# Altium schematic sheet Sheet1.SchDoc
size A3
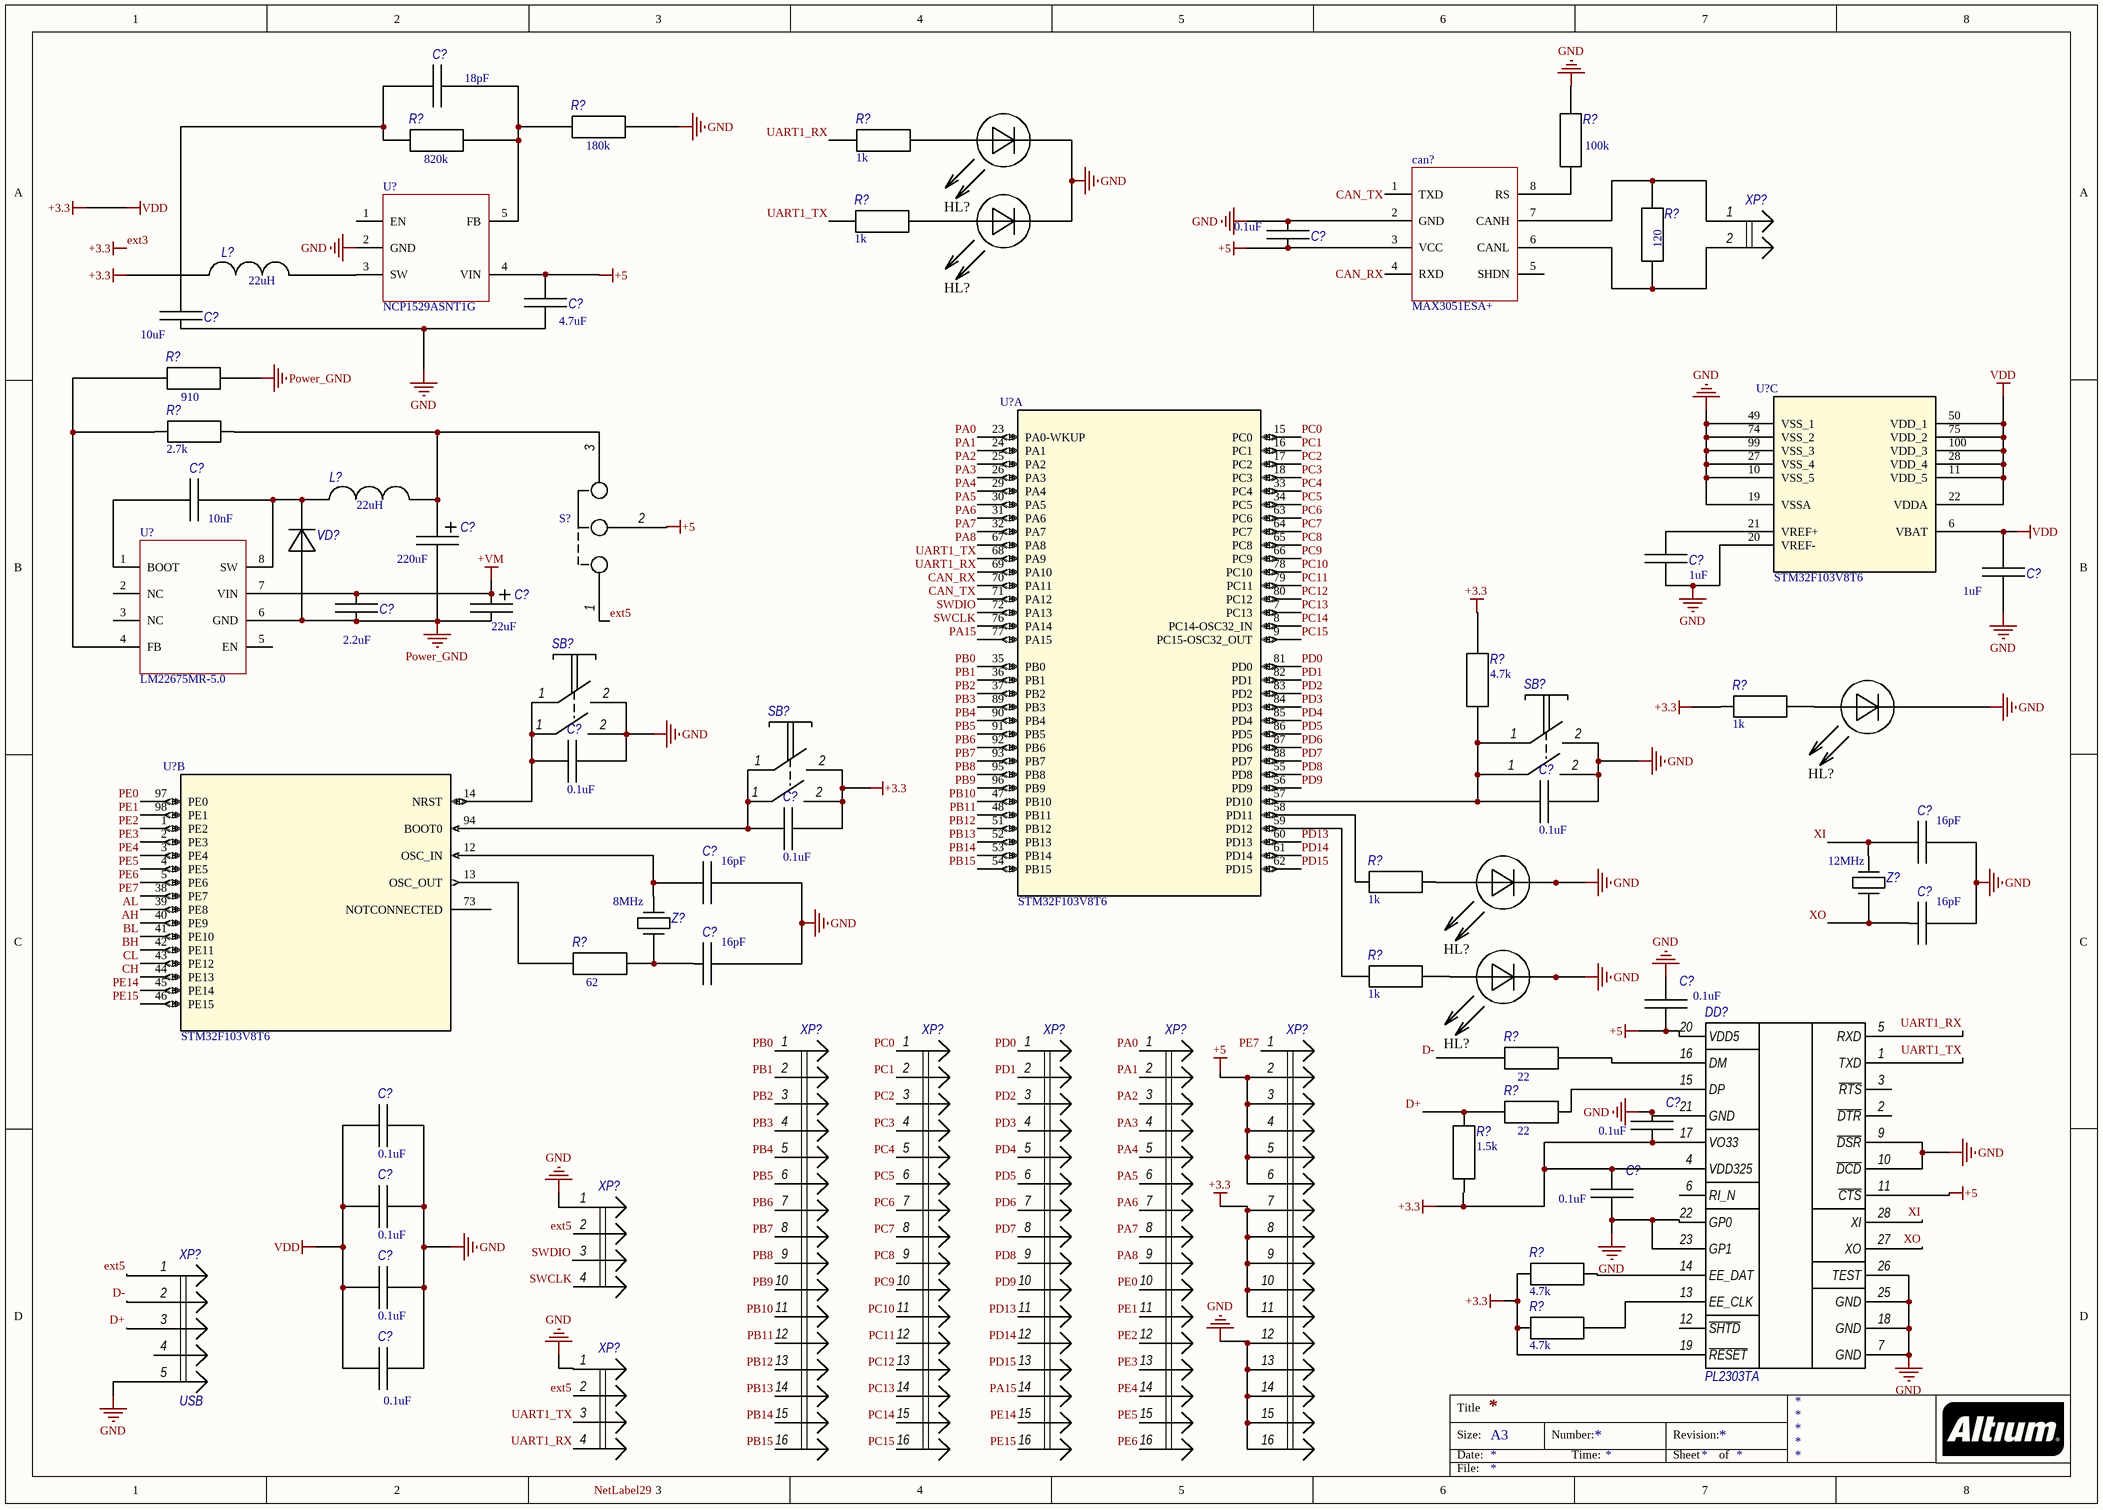
[diagram p0: Sheet1.SchDoc]

## Parts
(Parts that share a designator on the sheet are numbered #1, #2 ... from top to bottom, then left to right.)
C?#1  value 18pF  [C0805C]
C?#2  value 0.1uF  [C0805C]
C?#3  value 4.7uF  [C0805C]
C?#4  value 10uF  [C0805C]
C?#5  value 10nF  [C0805C]
C?#6  value 220uF  [CAP-8x12]
C?#7  value 1uF  [C0805C]
C?#8  value 1uF  [C0805C]
C?#9  value 2.2uF  [C1812C]
C?#10  value 22uF  [CAP-К50-35]
C?#11  value 0.1uF  [C0805C]
C?#12  value 0.1uF  [C0805C]
C?#13  value 0.1uF  [C0805C]
C?#14  value 16pF  [C0805C]
C?#15  value 16pF  [C0805C]
C?#16  value 16pF  [C0805C]
C?#17  value 16pF  [C0805C]
C?#18  value 0.1uF  [C0805C]
C?#19  value 0.1uF  [C0805C]
C?#20  value 0.1uF  [C0805C]
C?#21  value 0.1uF  [C0805C]
C?#22  value 0.1uF  [C0805C]
C?#23  value 0.1uF  [C0805C]
C?#24  value 0.1uF  [C0805C]
can?  MAX3051ESA+  [MAX3051ESA+]
DD?  PL2303TA  [SSOP28_N]
HL?#1  LED  [C0603D]  (value not drawn)
HL?#2  LED  [C0603D]  (value not drawn)
HL?#3  LED  [C0603D]  (value not drawn)
HL?#4  LED  [C0603D]  (value not drawn)
HL?#5  LED  [C0603D]  (value not drawn)
L?#1  value 22uH  [IND0488-G-E]
L?#2  value 22uH  [IND0488-G-E]
R?#1  value 180k  [C0805R]
R?#2  value 820k  [C0805R]
R?#3  value 1k  [C0805R]
R?#4  value 100k  [C0805R]
R?#5  value 1k  [C0805R]
R?#6  value 120  [C0805R]
R?#7  value 910  [C0805R]
R?#8  value 2.7k  [C0805R]
R?#9  value 4.7k  [C0805R]
R?#10  value 1k  [C0805R]
R?#11  value 1k  [C0805R]
R?#12  value 62  [C0805R]
R?#13  value 1k  [C0805R]
R?#14  value 22  [C0805R]
R?#15  value 22  [C0805R]
R?#16  value 1.5k  [C0805R]
R?#17  value 4.7k  [C0805R]
R?#18  value 4.7k  [C0805R]
S?  (no value)  [PLS-3]
SB?#1  (no value)  [TS-1170S]
SB?#2  (no value)  [TS-1170S]
SB?#3  (no value)  [TS-1170S]
U?#1  NCP1529ASNT1G  [NCP1529ASNT1G]
U?#2  STM32F103V8T6  [LQFP100-14x14mm]  (part C of 3)
U?#3  STM32F103V8T6  [LQFP100-14x14mm]  (part A of 3)
U?#4  LM22675MR-5.0  [LM22675MR-5.0/NOPB]
U?#5  STM32F103V8T6  [LQFP100-14x14mm]  (part B of 3)
VD?  (no value)  [DO-214AA]
XP?#1  (no value)  [PLS-2]
XP?#2  (no value)  [PLS-4]
XP?#3  (no value)  [PLS-16]
XP?#4  (no value)  [PLS-16]
XP?#5  (no value)  [PLS-16]
XP?#6  (no value)  [PLS-16]
XP?#7  (no value)  [PLS-16]
XP?#8  USB  [USB_Micro-B_FCI_SMD]
XP?#9  (no value)  [PLS-4]
Z?#1  value 12MHz  [HC-49S]
Z?#2  value 8MHz  [HC-49S]

## Nets
+5: C?#2.2 C?#3.1 C?#18.1 can?.3(VCC) DD?.11(~{CTS}) DD?.20(VDD5) S?.2 U?#1.4(VIN) XP?#7.2 XP?#7.3 XP?#7.4 XP?#7.5 XP?#7.6
+VM: C?#9.1 C?#10.1 U?#4.7(VIN)
ext3: C?#8.1 C?#13.2 C?#19.1 C?#20.2 C?#21.1 C?#22.1 C?#23.1 C?#24.1 DD?.4(VDD325) DD?.17(VO33) DD?.19(~{RESET}) L?#1.1 R?#9.1 R?#10.1 R?#17.1 R?#18.1 SB?#3.2 U?#2.6(VBAT) U?#2.11(VDD_5) U?#2.22(VDDA) U?#2.28(VDD_4) U?#2.50(VDD_1) U?#2.75(VDD_2) U?#2.100(VDD_3) XP?#7.7 XP?#7.8 XP?#7.9 XP?#7.10 XP?#7.11  [also labelled +3.3, VDD]
GND: C?#2.1 C?#3.2 C?#4.2 C?#7.2 C?#8.2 C?#11.2 C?#12.2 C?#14.2 C?#15.2 C?#16.2 C?#17.2 C?#18.2 C?#19.2 C?#20.1 C?#21.2 C?#22.2 C?#23.2 C?#24.2 can?.2(GND) DD?.7(GND) DD?.9(~{DSR}) DD?.10(~{DCD}) DD?.18(GND) DD?.21(GND) DD?.22(GP0) DD?.23(GP1) DD?.25(GND) DD?.26(TEST) HL?#1.2 HL?#2.2 HL?#3.2 HL?#4.2 HL?#5.2 R?#1.1 R?#4.1 SB?#1.2 SB?#2.2 U?#1.2(GND) U?#2.10(VSS_5) U?#2.19(VSSA) U?#2.20(VREF-) U?#2.27(VSS_4) U?#2.49(VSS_1) U?#2.74(VSS_2) U?#2.99(VSS_3) XP?#2.1 XP?#7.12 XP?#7.13 XP?#7.14 XP?#7.15 XP?#7.16 XP?#8.5 XP?#9.1
Power_GND: C?#6.2 C?#9.2 C?#10.2 R?#7.1 U?#4.6(GND) VD?.A
AH: U?#5.40(PE9)
AL: U?#5.39(PE8)
BH: U?#5.42(PE11)
BL: U?#5.41(PE10)
CAN_RX: can?.4(RXD) U?#3.70(PA11)
CAN_TX: can?.1(TXD) U?#3.71(PA12)
CH: U?#5.44(PE13)
CL: U?#5.43(PE12)
D+: R?#15.2 R?#16.2 XP?#8.3
D-: R?#14.2 XP?#8.2
ext5: S?.1 XP?#2.2 XP?#8.1 XP?#9.2
PA0: U?#3.23(PA0-WKUP) XP?#6.1
PA1: U?#3.24(PA1) XP?#6.2
PA2: U?#3.25(PA2) XP?#6.3
PA3: U?#3.26(PA3) XP?#6.4
PA4: U?#3.29(PA4) XP?#6.5
PA5: U?#3.30(PA5) XP?#6.6
PA6: U?#3.31(PA6) XP?#6.7
PA7: U?#3.32(PA7) XP?#6.8
PA8: U?#3.67(PA8) XP?#6.9
PA15: U?#3.77(PA15) XP?#5.14
PB0: U?#3.35(PB0) XP?#3.1
PB1: U?#3.36(PB1) XP?#3.2
PB2: U?#3.37(PB2) XP?#3.3
PB3: U?#3.89(PB3) XP?#3.4
PB4: U?#3.90(PB4) XP?#3.5
PB5: U?#3.91(PB5) XP?#3.6
PB6: U?#3.92(PB6) XP?#3.7
PB7: U?#3.93(PB7) XP?#3.8
PB8: U?#3.95(PB8) XP?#3.9
PB9: U?#3.96(PB9) XP?#3.10
PB10: U?#3.47(PB10) XP?#3.11
PB11: U?#3.48(PB11) XP?#3.12
PB12: U?#3.51(PB12) XP?#3.13
PB13: U?#3.52(PB13) XP?#3.14
PB14: U?#3.53(PB14) XP?#3.15
PB15: U?#3.54(PB15) XP?#3.16
PC0: U?#3.15(PC0) XP?#4.1
PC1: U?#3.16(PC1) XP?#4.2
PC2: U?#3.17(PC2) XP?#4.3
PC3: U?#3.18(PC3) XP?#4.4
PC4: U?#3.33(PC4) XP?#4.5
PC5: U?#3.34(PC5) XP?#4.6
PC6: U?#3.63(PC6) XP?#4.7
PC7: U?#3.64(PC7) XP?#4.8
PC8: U?#3.65(PC8) XP?#4.9
PC9: U?#3.66(PC9) XP?#4.10
PC10: U?#3.78(PC10) XP?#4.11
PC11: U?#3.79(PC11) XP?#4.12
PC12: U?#3.80(PC12) XP?#4.13
PC13: U?#3.7(PC13) XP?#4.14
PC14: U?#3.8(PC14-OSC32_IN) XP?#4.15
PC15: U?#3.9(PC15-OSC32_OUT) XP?#4.16
PD0: U?#3.81(PD0) XP?#5.1
PD1: U?#3.82(PD1) XP?#5.2
PD2: U?#3.83(PD2) XP?#5.3
PD3: U?#3.84(PD3) XP?#5.4
PD4: U?#3.85(PD4) XP?#5.5
PD5: U?#3.86(PD5) XP?#5.6
PD6: U?#3.87(PD6) XP?#5.7
PD7: U?#3.88(PD7) XP?#5.8
PD8: U?#3.55(PD8) XP?#5.9
PD9: U?#3.56(PD9) XP?#5.10
PD13: U?#3.60(PD13) XP?#5.11
PD14: U?#3.61(PD14) XP?#5.12
PD15: U?#3.62(PD15) XP?#5.13
PE0: U?#5.97(PE0) XP?#6.10
PE1: U?#5.98(PE1) XP?#6.11
PE2: U?#5.1(PE2) XP?#6.12
PE3: U?#5.2(PE3) XP?#6.13
PE4: U?#5.3(PE4) XP?#6.14
PE5: U?#5.4(PE5) XP?#6.15
PE6: U?#5.5(PE6) XP?#6.16
PE7: U?#5.38(PE7) XP?#7.1
PE14: U?#5.45(PE14) XP?#5.15
PE15: U?#5.46(PE15) XP?#5.16
SWCLK: U?#3.76(PA14) XP?#2.4
SWDIO: U?#3.72(PA13) XP?#2.3
UART1_RX: DD?.5(RXD) R?#3.2 U?#3.69(PA10) XP?#9.4
UART1_TX: DD?.1(TXD) R?#5.2 U?#3.68(PA9) XP?#9.3
XI: C?#14.1 DD?.28(XI) Z?#1.2(OSC2)
XO: C?#16.1 DD?.27(XO) Z?#1.1(OSC1)
NetC?#1_1: C?#1.1 C?#4.1 R?#2.2
NetC?#1_2: C?#1.2 R?#1.2 R?#2.1 U?#1.5(FB)
NetC?#5_1: C?#5.1 U?#4.1(BOOT)
NetC?#5_2: C?#5.2 L?#2.1 U?#4.8(SW) VD?.C
NetC?#6_1: C?#6.1 L?#2.2 R?#8.2 S?.3
NetC?#7_1: C?#7.1 U?#2.21(VREF+)
NetC?#11_1: C?#11.1 SB?#1.1 U?#5.14(NRST)
NetC?#12_1: C?#12.1 R?#9.2 SB?#2.1 U?#3.57(PD10)
NetC?#13_1: C?#13.1 SB?#3.1 U?#5.94(BOOT0)
NetC?#15_1: C?#15.1 U?#5.12(OSC_IN) Z?#2.2(OSC2)
NetC?#17_1: C?#17.1 R?#12.1 Z?#2.1(OSC1)
Netcan?_6: can?.6(CANL) R?#6.1 XP?#1.2
Netcan?_7: can?.7(CANH) R?#6.2 XP?#1.1
Netcan?_8: can?.8(RS) R?#4.2
NetDD?_13: DD?.13(EE_CLK) R?#18.2
NetDD?_14: DD?.14(EE_DAT) R?#17.2
NetDD?_15: DD?.15(DP) R?#15.1
NetDD?_16: DD?.16(DM) R?#14.1
NetHL?#1_1: HL?#1.1 R?#3.1
NetHL?#2_1: HL?#2.1 R?#5.1
NetHL?#3_1: HL?#3.1 R?#10.2
NetHL?#4_1: HL?#4.1 R?#11.2
NetHL?#5_1: HL?#5.1 R?#13.2
NetL?#1_2: L?#1.2 U?#1.3(SW)
NetR?#7_2: R?#7.2 R?#8.1 U?#4.4(FB)
NetR?#11_1: R?#11.1 U?#3.58(PD11)
NetR?#12_2: R?#12.2 U?#5.13(OSC_OUT)
NetR?#13_1: R?#13.1 U?#3.59(PD12)

Not connected (* = marked no-connect by the designer): can? 5(SHDN); DD? 2(~{DTR}) 3(~{RTS}) 6(RI_N) 12(~{SHTD}); R?#16 1; U?#1 1(EN); U?#4 2(NC) 3(NC) 5(EN); U?#5 73(NOTCONNECTED); XP?#8 4

## Notes on the sheet
- Labels drawn without touching a wire or pin: NetLabel29
- Title
- Size:
- Date:
- A3
- Number:
- Time:
- Revision:
- Sheet
- of
- File:

## Library data of the parts
C?#1-C?#5 C?#7-C?#9 C?#11-C?#24 = Cap: ComponentLink1Description: New link
  C?#1: ComponentLink1URL: https://www.chipdip.ru/product/grm2165c1h180j
  C?#2 C?#11-C?#13 C?#18-C?#24: ComponentLink1URL: https://www.chipdip.ru/product0/43780
  C?#3: ComponentLink1URL: https://www.chipdip.ru/product/grm21br61e475ka12l
  C?#4: ComponentLink1URL: https://www.chipdip.ru/product0/9000671061
  C?#5: ComponentLink1URL: https://www.chipdip.ru/product/grm216r71h103k
  C?#7 C?#8: ComponentLink1URL: https://www.chipdip.ru/product/grm21br71c105k
  C?#9: ComponentLink1URL: https://www.chipdip.ru/product0/9000144596
  C?#14-C?#17: ComponentLink1URL: https://www.chipdip.ru/product/grm2165c1h160j
C?#6 C?#10 = CapPol: ComponentLink1Description: New link
  C?#6: ComponentLink1URL: https://www.chipdip.ru/product0/9000565758
  C?#10: ComponentLink1URL: https://www.chipdip.ru/product0/9000565851
L?#1 L?#2 = Inductor: ComponentLink1Description: New link
  L?#1: ComponentLink1URL: https://www.chipdip.ru/product/b82472g6222m000-2.2
  L?#2: ComponentLink1URL: https://www.chipdip.ru/product/b82472g6223m000-22
R?#1-R?#18 = res: ComponentLink1Description: New link
  R?#1: ComponentLink1URL: https://www.chipdip.ru/product0/9000079544
  R?#2: ComponentLink1URL: https://www.chipdip.ru/product0/9000079576
  R?#3 R?#5 R?#10 R?#11 R?#13: ComponentLink1URL: https://www.chipdip.ru/product0/9000079486
  R?#4: ComponentLink1URL: https://www.chipdip.ru/product0/9000079538
  R?#6: ComponentLink1URL: https://www.chipdip.ru/product0/9000079464
  R?#7: ComponentLink1URL: https://www.chipdip.ru/product0/9000079485
  R?#8: ComponentLink1URL: https://www.chipdip.ru/product0/9000079496
  R?#9 R?#17 R?#18: ComponentLink1URL: https://www.chipdip.ru/product0/9000079502
  R?#12: ComponentLink1URL: https://www.chipdip.ru/product0/9000079457
  R?#14 R?#15: ComponentLink1URL: https://www.chipdip.ru/product0/9000079446
  R?#16: ComponentLink1URL: https://www.chipdip.ru/product0/9000079490
S? = jump
SB?#1-SB?#3 = SW-PB-2: ComponentLink1Description: New link; ComponentLink1URL: https://www.chipdip.ru/product/tyco-1571563-9-fsm8jsmatr
U?#2 U?#3 U?#5 = STM32F103V8T6: No Description Available; Vendor: STMicroelectronics; Built_By: EMA_UL_Team; SourceLibrary: Updates_to_database_2020-10-19; Manufacturer_Part_Number: STM32F103V8T6; Copyright: Copyright (C) 2018 Accelerated Designs. All rights reserved; RefDes: RefDes; Type: DEV
U?#4 = LM22675MR-5.0/NOPB: ComponentLink1Description: New link; ComponentLink1URL: https://www.chipdip.ru/product/lm22675mr-5.0-nopb-2
VD? = DIODE: ComponentLink1Description: New link; ComponentLink1URL: https://www.chipdip.ru/product/sk16-diotec
XP?#1 = Connector-2
XP?#2 XP?#9 = Connector-4
XP?#3-XP?#7 = Connector-16
XP?#8 = Connector-5: ComponentLink1Description: New link; ComponentLink1URL: https://www.chipdip.ru/product/micro-usb-5s-b
Z?#1 Z?#2 = XTAL: ComponentLink1Description: New link
  Z?#1: ComponentLink1URL: https://www.chipdip.ru/product/12mhz-hc-49sm
  Z?#2: ComponentLink1URL: https://www.chipdip.ru/product0/9000523942
can? = MAX3051ESA+: ComponentLink1Description: New link; ComponentLink1URL: https://www.chipdip.ru/product/max3051esa-maxim
DD? = PL2303TA: ComponentLink1Description: New link; ComponentLink1URL: https://www.chipdip.ru/product/pl2303ta
U?#1 = NCP1529ASNT1G: ComponentLink1Description: New link; ComponentLink1URL: https://www.chipdip.ru/product/ncp1529asnt1g